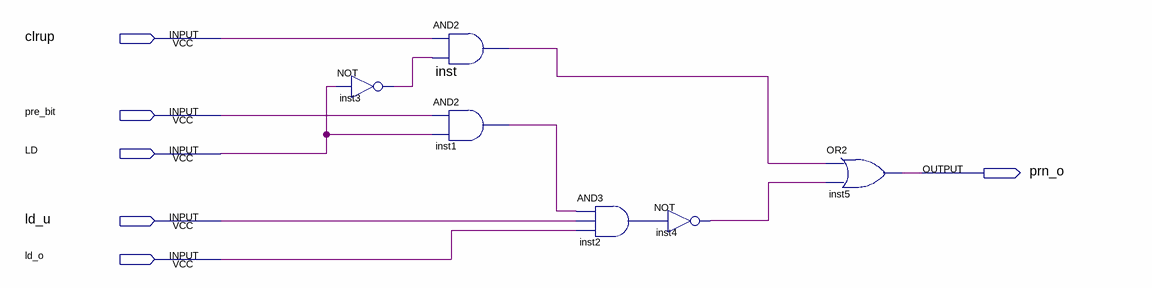
[diagram p0: schematic sheet]
// Quartus schematic clrup_mux.bdf as structural Verilog: 6 symbols, 6 pins
module clrup_mux (
  input  clrup,
  input  pre_bit,
  input  LD,
  input  ld_u,
  input  ld_o,
  output prn_o
);

  wire inst1_out, inst2_out, inst3_out, inst4_out, inst_out;

  not inst3 (inst3_out, LD);
  and inst (inst_out, clrup, inst3_out);
  and inst1 (inst1_out, pre_bit, LD);
  and inst2 (inst2_out, inst1_out, ld_u, ld_o);
  not inst4 (inst4_out, inst2_out);
  or inst5 (prn_o, inst_out, inst4_out);
endmodule
